# EAGLE design Displayboard (EAGLE 6.4)
Displayboard
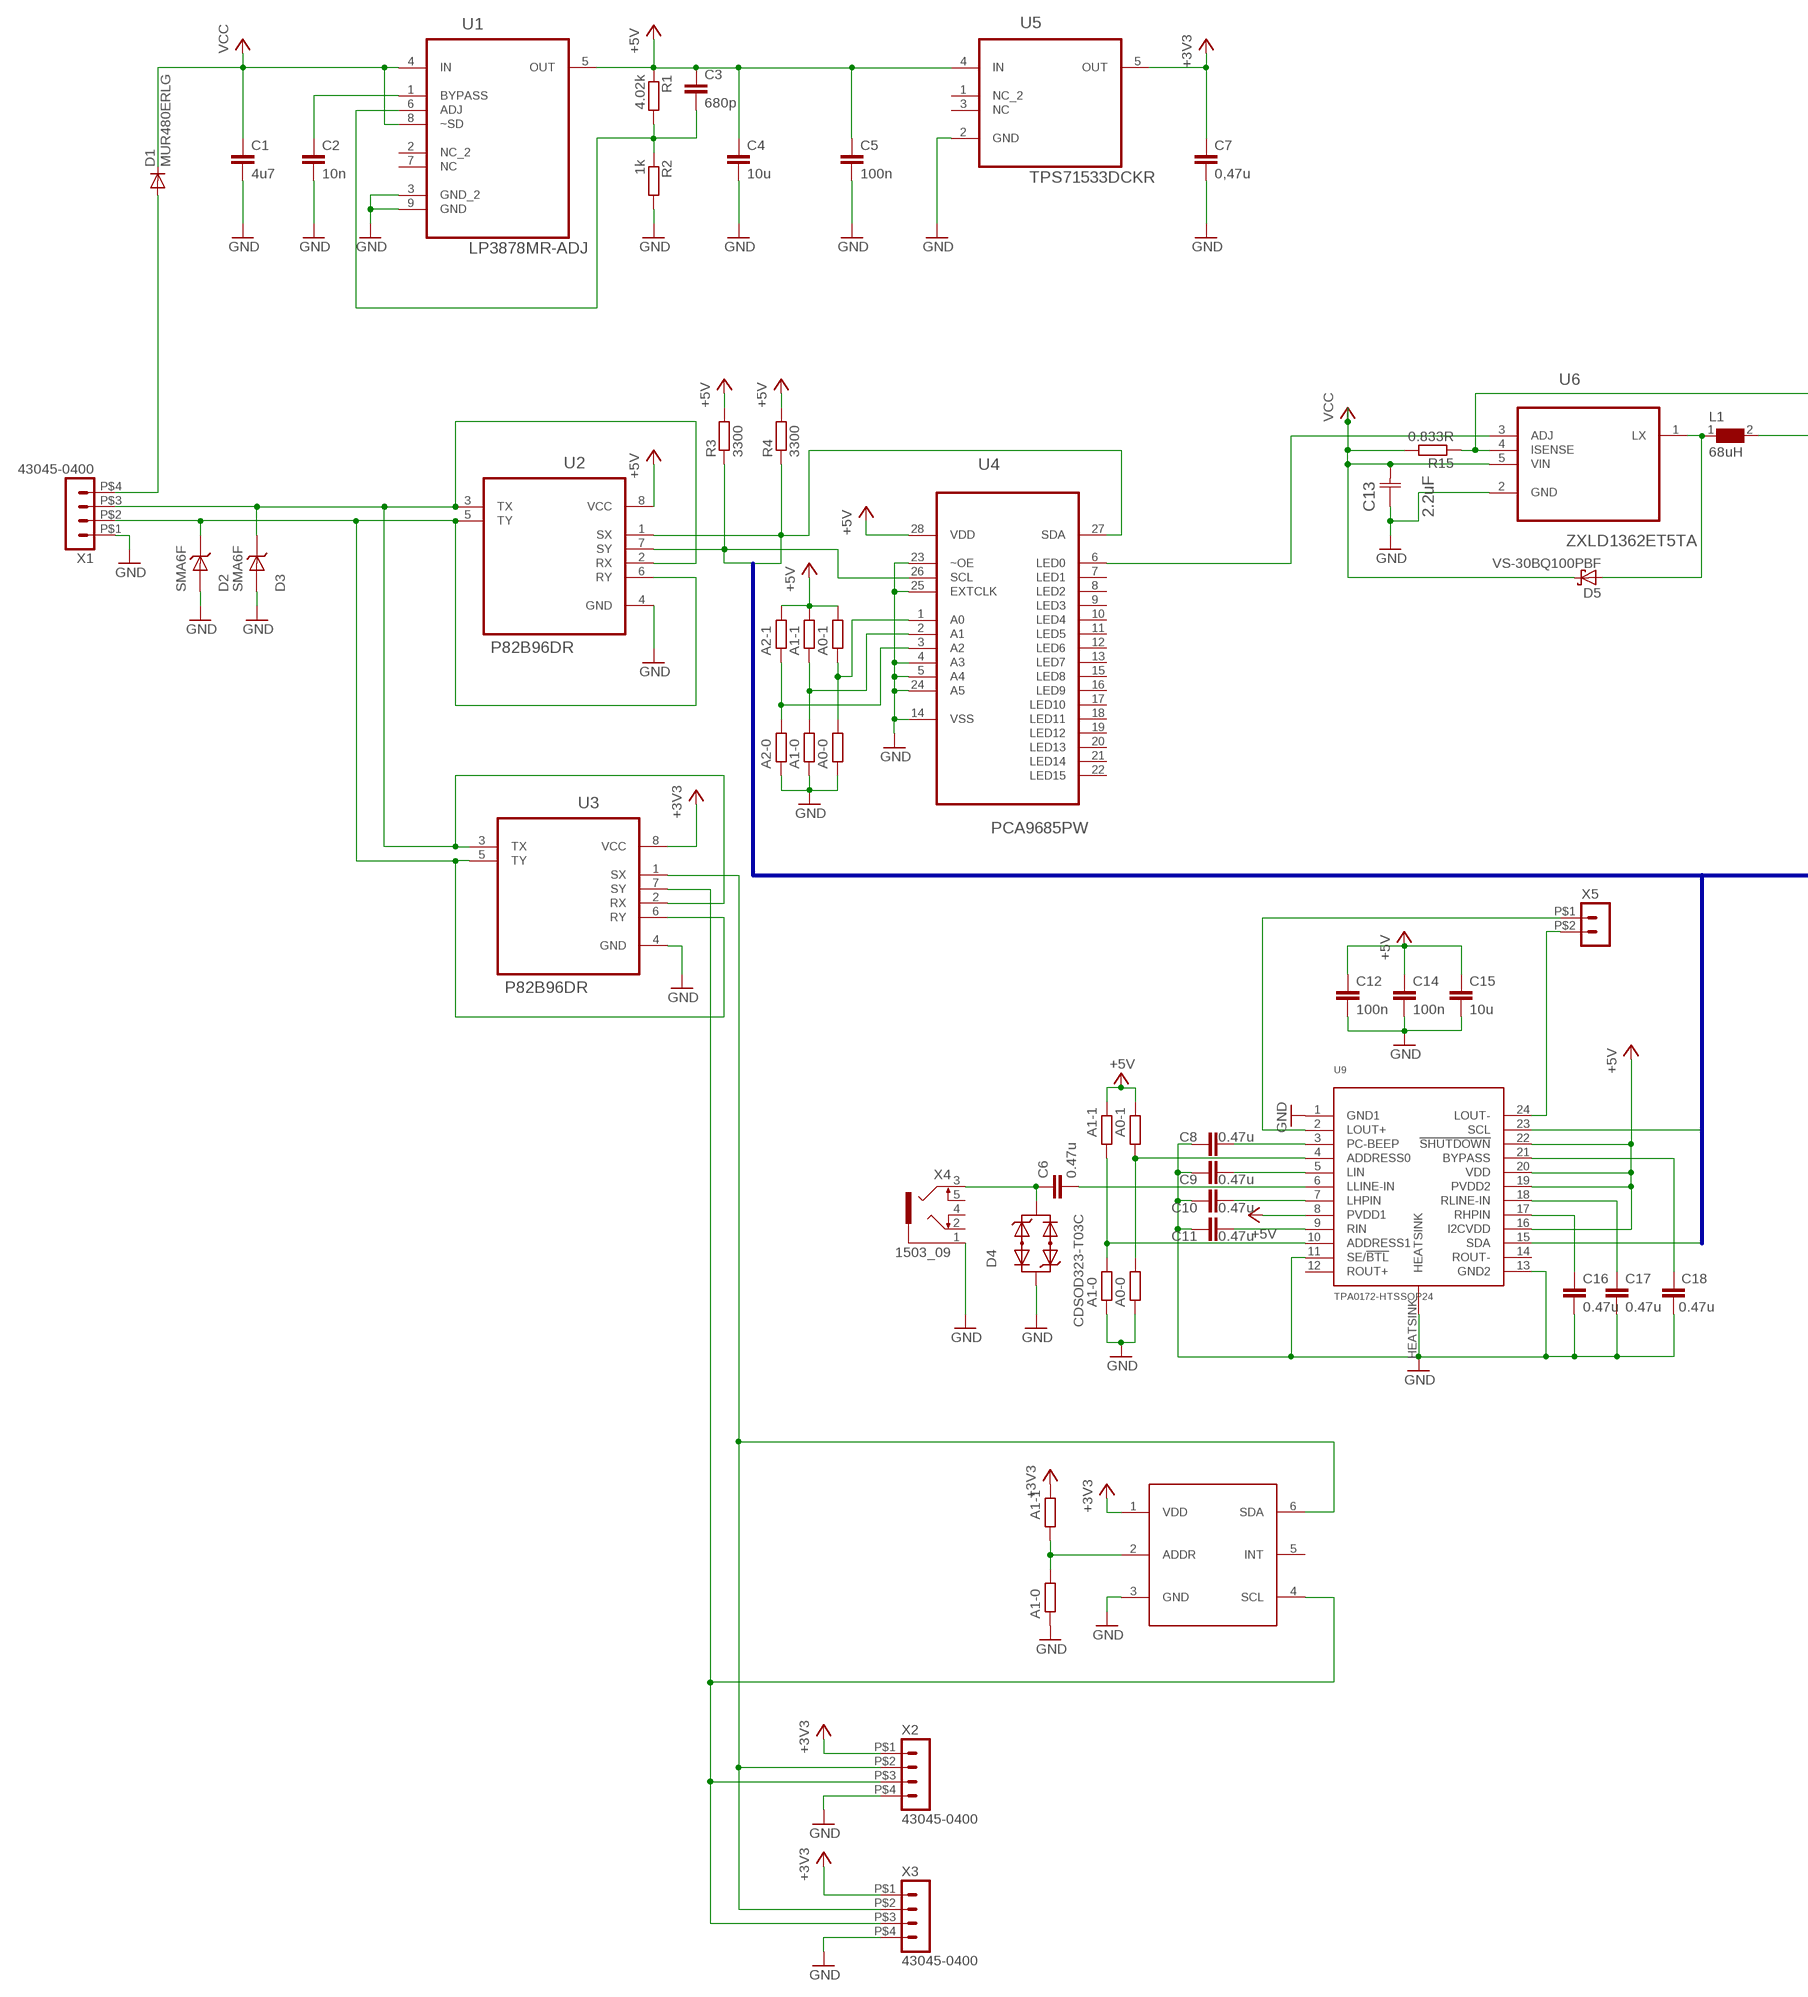
[diagram p0: schematic, sheet 1, part 1 of 2]
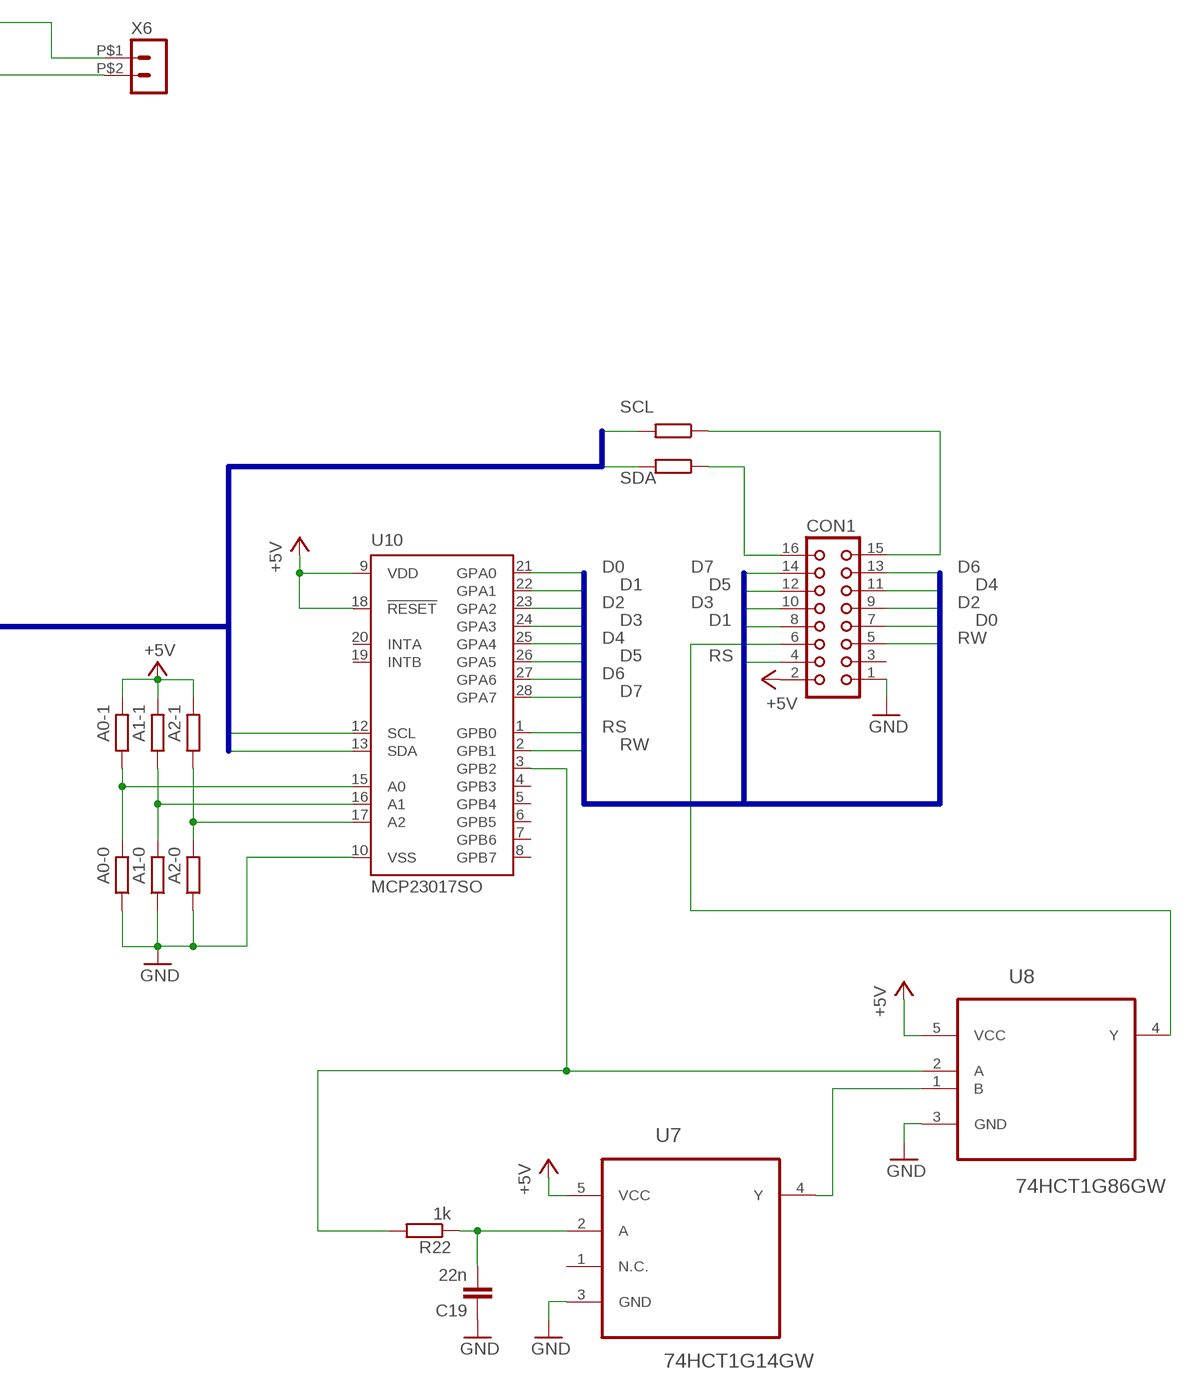
[diagram p1: schematic, sheet 1, part 2 of 2]

## Parts
C1  4u7  C-EUC0805  [C0805]
C2  10n  C-EUC0805  [C0805]
C3  680p  C-EUC0805  [C0805]
C4  10u  C-EUC0805  [C0805]
C5  100n  C-EUC0805  [C0805]
C6  0.47u  C-EUC0805  [C0805]
C7  0,47u  C-EUC0805  [C0805]
C8  0.47u  C-EUC0805  [C0805]
C9  0.47u  C-EUC0805  [C0805]
C10  0.47u  C-EUC0805  [C0805]
C11  0.47u  C-EUC0805  [C0805]
C12  100n  C-EUC0805  [C0805]
C13  2.2uF  08053C225KAT2A  [CAPC2013X152N]
C14  100n  C-EUC0805  [C0805]
C15  10u  C-EUC0805  [C0805]
C16  0.47u  C-EUC0805  [C0805]
C17  0.47u  C-EUC0805  [C0805]
C18  0.47u  C-EUC0805  [C0805]
C19  22n  C-EUC0805  [C0805]
CON1  CON16  [CON16]
D1  MUR480ERLG  MUR150RL  [DO41-10]
D2  SMA6F  [DO-221AC]
D3  SMA6F  [DO-221AC]
D4  CDSOD323-T03C  [SOD323]
D5  VS-30BQ100PBF  [DO-214AB]
L1  68uH  WE-PD4-74456168_L  [L]
R1  4.02k  R-EU_R0603  [R0603]
R2  1k  R-EU_R0603  [R0603]
R3  3300  R-EU_0204/7  [0204/7]
R4  3300  R-EU_0204/7  [0204/7]
R5  A2-1  R-EU_R0402  [R0402]
R6  A2-0  R-EU_R0402  [R0402]
R7  A1-1  R-EU_R0402  [R0402]
R8  A1-0  R-EU_R0402  [R0402]
R9  A0-1  R-EU_R0402  [R0402]
R10  A0-0  R-EU_R0402  [R0402]
R11  A1-1  R-EU_R0402  [R0402]
R12  A1-0  R-EU_R0402  [R0402]
R13  A0-1  R-EU_R0402  [R0402]
R14  A0-0  R-EU_R0402  [R0402]
R15  0.833R  R-EU_R0603  [R0603]
R16  A0-1  R-EU_R0402  [R0402]
R17  A0-0  R-EU_R0402  [R0402]
R18  A1-1  R-EU_R0402  [R0402]
R19  A1-0  R-EU_R0402  [R0402]
R20  A2-1  R-EU_R0402  [R0402]
R21  A2-0  R-EU_R0402  [R0402]
R22  1k  R-EU_0204/7  [0204/7]
R23  SCL  R-EU_R0402  [R0402]
R24  SDA  R-EU_R0402  [R0402]
R27  A1-1  R-EU_R0402  [R0402]
R28  A1-0  R-EU_R0402  [R0402]
U1  LP3878MR-ADJ  [SOIC127P600X168-8N]
U2  P82B96DR  [SOIC127P600X175-8N]
U3  P82B96DR  [SOIC127P600X175-8N]
U4  PCA9685PW  [SOP65P640X110-28N]
U5  TPS71533DCKR  [SOT65P210X110-5N]
U6  ZXLD1362ET5TA  [SOT95P270X145-5N]
U7  74HCT1G14GW  [SOT65P210X110-5N]
U8  74HCT1G86GW  [SOT65P210X110-5N]
U9  TPA0172-HTSSOP24  [HT-TSSOP-24]
U10  MCP23017SO  [SO28W]
U11  TSL2561  [TMB-6]
X1  43045-0400  HEADER_POS4_43045-0401  [43045-0400]
X2  43045-0400  HEADER_POS4_43045-0401  [43045-0400]
X3  43045-0400  HEADER_POS4_43045-0401  [43045-0400]
X4  1503_09  [1503_09]
X5  HEADER_POS2_43045-0200  [43045-0200]
X6  HEADER_POS2_43045-0200  [43045-0200]

## Nets
+3V3 [Normal Bcc]: C7.1 R27.2 U3.8(VCC) U5.5(OUT) U11.1(VDD) X2.P$1 X3.P$1
+5V [Normal Bcc]: C3.1 C4.1 C5.1 C12.1 C14.1 C15.1 CON1.2 R1.1 R3.2 R4.2 R5.2 R7.2 R9.2 R11.2 R13.2 R16.2 R18.2 R20.2 U1.5(OUT) U2.8(VCC) U4.28(VDD) U5.4(IN) U7.5(VCC) U8.5(VCC) U9.8(PVDD1) U9.16(I2CVDD) U9.19(PVDD2) U9.20(VDD) U9.22(!SHUTDOWN) U10.9(VDD) U10.18(!RESET)
D0: CON1.7 U10.21(GPA0)
D1: CON1.8 U10.22(GPA1)
D2: CON1.9 U10.23(GPA2)
D3: CON1.10 U10.24(GPA3)
D4: CON1.11 U10.25(GPA4)
D5: CON1.12 U10.26(GPA5)
D6: CON1.13 U10.27(GPA6)
D7: CON1.14 U10.28(GPA7)
GND: C1.2 C2.2 C4.2 C5.2 C7.2 C8.1 C9.1 C10.1 C11.1 C12.2 C13.1(C1) C14.2 C15.2 C16.2 C17.2 C18.1 C19.1 CON1.1 D2.AN D3.AN D4.P$1 R2.2 R6.1 R8.1 R10.1 R12.1 R14.1 R17.1 R19.1 R21.1 R28.1 U1.3(GND_2) U1.9(GND) U2.4(GND) U3.4(GND) U4.4(A3) U4.5(A4) U4.14(VSS) U4.23(~OE) U4.24(A5) U4.25(EXTCLK) U5.2(GND) U6.2(GND) U7.3(GND) U8.3(GND) U9.1(GND1) U9.11(SE/!BTL) U9.13(GND2) U9.HEATSINK U10.10(VSS) U11.3(GND) X1.P$1 X2.P$4 X3.P$4 X4.1
N$1 [LED Current]: R15.1 U6.4(ISENSE) X6.P$1
N$2: D3.KAT U2.2(RX) U2.3(TX) U3.2(RX) U3.3(TX) X1.P$3
N$3: R22.2 U8.2(A) U10.3(GPB2)
N$4: C16.1 U9.17(RHPIN)
N$5: C17.1 U9.18(RLINE-IN)
N$6 [LED Current]: L1.2 X6.P$2
N$7: U3.1(SX) U11.6(SDA) X2.P$2 X3.P$2
N$8: U4.6(LED0) U6.3(ADJ)
N$9: U3.7(SY) U11.4(SCL) X2.P$3 X3.P$3
N$10 [LED Current]: D5.A L1.1 U6.1(LX)
N$11: U9.24(LOUT-) X5.P$2
N$12: U9.2(LOUT+) X5.P$1
N$13: C6.2 U9.6(LLINE-IN)
N$14: C11.2 U9.9(RIN)
N$15: C10.2 U9.7(LHPIN)
N$16: C9.2 U9.5(LIN)
N$17: C8.2 U9.3(PC-BEEP)
N$18: R18.1 R19.2 U10.16(A1)
N$19: R16.1 R17.2 U10.15(A0)
N$20: R5.1 R6.2 U4.3(A2)
N$21: R20.1 R21.2 U10.17(A2)
N$22: D2.KAT U2.5(TY) U2.6(RY) U3.5(TY) U3.6(RY) X1.P$2
N$23: C18.2 U9.21(BYPASS)
N$24: C3.2 R1.2 R2.1 U1.6(ADJ)
N$25 [Big Vcc]: D1.A X1.P$4
N$26: C2.1 U1.1(BYPASS)
N$27: CON1.16 R24.1
N$28: CON1.15 R23.1
N$29: R7.1 R8.2 U4.2(A1)
N$30: C19.2 R22.1 U7.2(A)
N$31: U7.4(Y) U8.1(B)
N$32: CON1.6 U8.4(Y)
N$34: R27.1 R28.2 U11.2(ADDR)
N$41: R13.1 R14.2 U9.4(ADDRESS0)
N$42: R11.1 R12.2 U9.10(ADDRESS1)
N$43: R9.1 R10.2 U4.1(A0)
N$49: C6.1 D4.P$2 X4.3
RS: CON1.4 U10.1(GPB0)
RW: CON1.5 U10.2(GPB1)
SCL: R3.1 R23.2 U2.7(SY) U4.26(SCL) U9.23(SCL) U10.12(SCL)
SDA: R4.1 R24.2 U2.1(SX) U4.27(SDA) U9.15(SDA) U10.13(SDA)
VCC [Big Vcc]: C1.1 C13.2(C2) D1.C D5.K(C) R15.2 U1.4(IN) U1.8(~SD) U6.5(VIN)
Unconnected: CON1.3 U1.2(NC_2) U1.7(NC) U4.7(LED1) U4.8(LED2) U4.9(LED3) U4.10(LED4) U4.11(LED5) U4.12(LED6) U4.13(LED7) U4.15(LED8) U4.16(LED9) U4.17(LED10) U4.18(LED11) U4.19(LED12) U4.20(LED13) U4.21(LED14) U4.22(LED15) U5.1(NC_2) U5.3(NC) U7.1(N.C.) U9.12(ROUT+) U9.14(ROUT-) U10.4(GPB3) U10.5(GPB4) U10.6(GPB5) U10.7(GPB6) U10.8(GPB7) U10.19(INTB) U10.20(INTA) U11.5(INT) X4.2 X4.4 X4.5

## Buses
D[0..7],RS,RW
SDA,SCL

## Library data of the parts
C1-C12 C14-C19 = rcl:C-EU: CAPACITOR, European symbol
C13 = AVX_By_element14_Batch_1:08053C225KAT2A: Capacitor 0805; MPN: 08053C225KAT2A; OC_FARNELL: 1657931; OC_NEWARK: 10R5975; SUPPLIER: AVX; TOLERANCE: ±10%; VOLTAGERATING: 25V
CON1 = con-harting:CON16: CONNECTOR; OC_FARNELL: unknown; OC_NEWARK: unknown
D1 = diode:MUR150RL: DIODE
D2 D3 = MyComponents:SMA6F
D4 = MyComponents:CDSOD323-T03C
D5 = MyComponents:VS-30BQ100PBF
L1 = WE-PD4:WE-PD4: SMD-Power Inductors WE-PD4 - Current loading up to 35 A - Compact size - Low-loss ferrite core - High storage capacity - Industry standardized size - Application frequency range up to 10 MHz -- Is recommended for the application with switching regulators from National Semiconductor, Linear Technology, Texas Instruments and Fairchild Semiconductor -- Noise suppression -- Perfectly suitable for switching regulators with extremely high efficiency; MPN: 74456168; OC_FARNELL: 1636136; OC_NEWARK: 08P2689; PACKAGE: Type_L; SUPPLIER: Wuerth Elektronik
R1 R2 R5-R21 R23 R24 R27 R28 = resistor:R-EU_: RESISTOR, European symbol
R3 R4 R22 = rcl:R-EU_: RESISTOR, European symbol
U1 = Texas:LP3878MR-ADJ: Voltage Regulator; MPN: LP3878MR-ADJ; OC_FARNELL: 1286784; OC_NEWARK: 65K6513; PACKAGE: SOIC-8; SUPPLIER: NationalSemiconductor
U2 U3 = Texas:P82B96DR: DUAL BIDIRECTIONAL BUS BUFFER; MPN: P82B96DR; OC_FARNELL: 1576671; OC_NEWARK: 88K6385; PACKAGE: SOIC-8; SUPPLIER: Texas Instruments
U4 = NXP_By_element14_Batch_1:PCA9685PW: 16-channel, 12-bit PWM Fm+ I2C-bus LED controller; MPN: PCA9685PW; OC_FARNELL: 1854074; OC_NEWARK: 19T6398; PACKAGE: TSSOP-28; SUPPLIER: NXP
U5 = Texas:TPS71533DCKR: Linear Regulator; MPN: TPS71533DCKR; OC_FARNELL: 1135383; OC_NEWARK: 77C0815; PACKAGE: SC-70-5; SUPPLIER: Texas Instruments
U6 = ZEtex:ZXLD1362ET5TA: 60V 1A LED DRIVER WITH AEC-Q100; MPN: ZXLD1362ET5TA; OC_FARNELL: 1843876; OC_NEWARK: 12T2272; PACKAGE: SOT-5; SUPPLIER: DIODES INC.
U7 = NXP_By_element14_Batch_1:74HCT1G14GW: Inverting Schmitt trigger; MPN: 74HCT1G14GW; OC_FARNELL: 1085264; OC_NEWARK: 99K0543; PACKAGE: SOT-5; SUPPLIER: NXP
U8 = NXP_By_element14_Batch_1:74HCT1G86GW: 2-input EXCLUSIVE-OR gate; MPN: 74HCT1G86GW; OC_FARNELL: 1085266; OC_NEWARK: 99K0545; PACKAGE: SOT-5; SUPPLIER: NXP
U9 = MyComponents:TPA0172-HTSSOP24
U10 = microchip:MCP23017: http://ww1.microchip.com/downloads/en/DeviceDoc/21952a.pdf Source: http://ww1.microchip.com/downloads/en/DeviceDoc/21952a.pdf; MF: MICROCHIP; MPN: MCP23017-E/SO; OC_FARNELL: 1332087; OC_NEWARK: 31K2958
U11 = MyComponents:TSL2561
X1-X3 = con-molex-micro-fit-3_0:HEADER_POS4_?: Molex - Micro-Fit 3.0 Series connector, 3.00mm (0.118") pitch header, 4 positions.
X4 = con-lumberg:1503_09: Jack connectors according to JISC 6560, 3.5 mm Klinkeneinbaukupplung nach JISC 6560, 3,5 mm, 3-polig/ stereo, abgewinkelte Ausführung, mit 2 Öffnern und Lötaugen, für Leiterplatten Rückseitenmontage Source: http://www.lumberg.com/Produkte/PDFs/1503_09.pdf; OC_FARNELL: 1243244; OC_NEWARK: unknown
X5 X6 = con-molex-micro-fit-3_0:HEADER_POS2_?: Molex - Micro-Fit 3.0 Series connector, 3.00mm (0.118") pitch header, 2 positions.

## Net classes
0 default: width 0.254 mm, clearance 0.254 mm
1 Normal Bcc: width 0.254 mm, clearance 0.254 mm
2 Big Vcc: width 0.762 mm, clearance 0.254 mm
3 LED Current: width 0.381 mm, clearance 0.254 mm

## Board
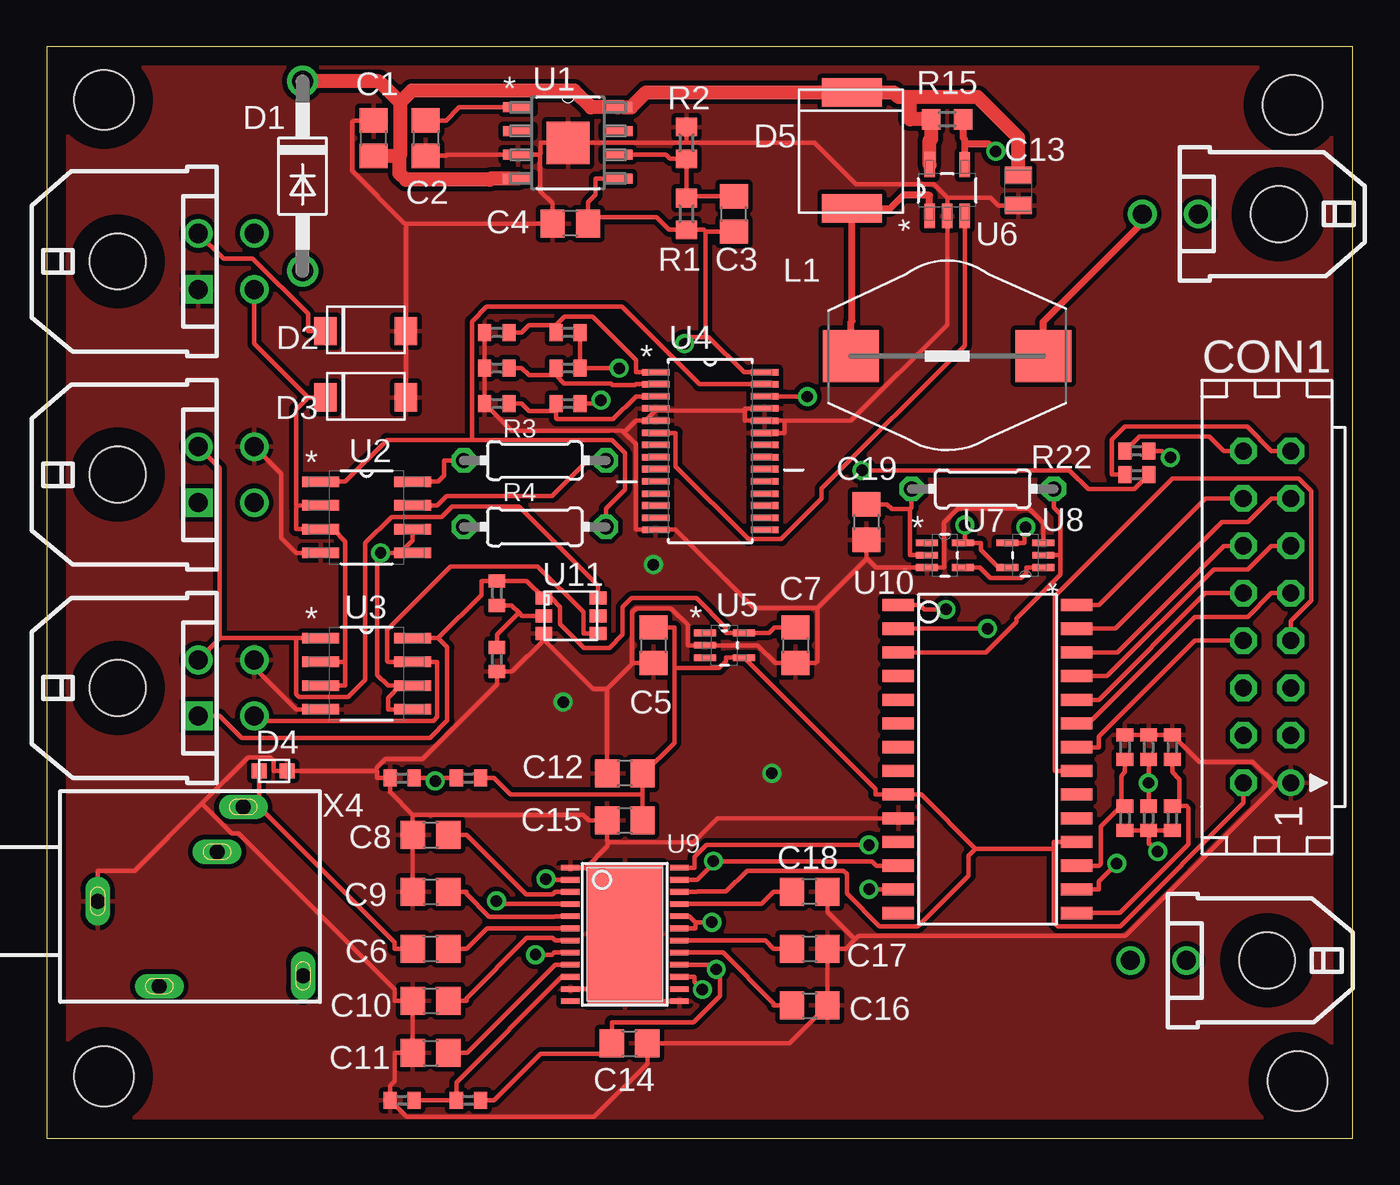
[diagram p2: board, top side]
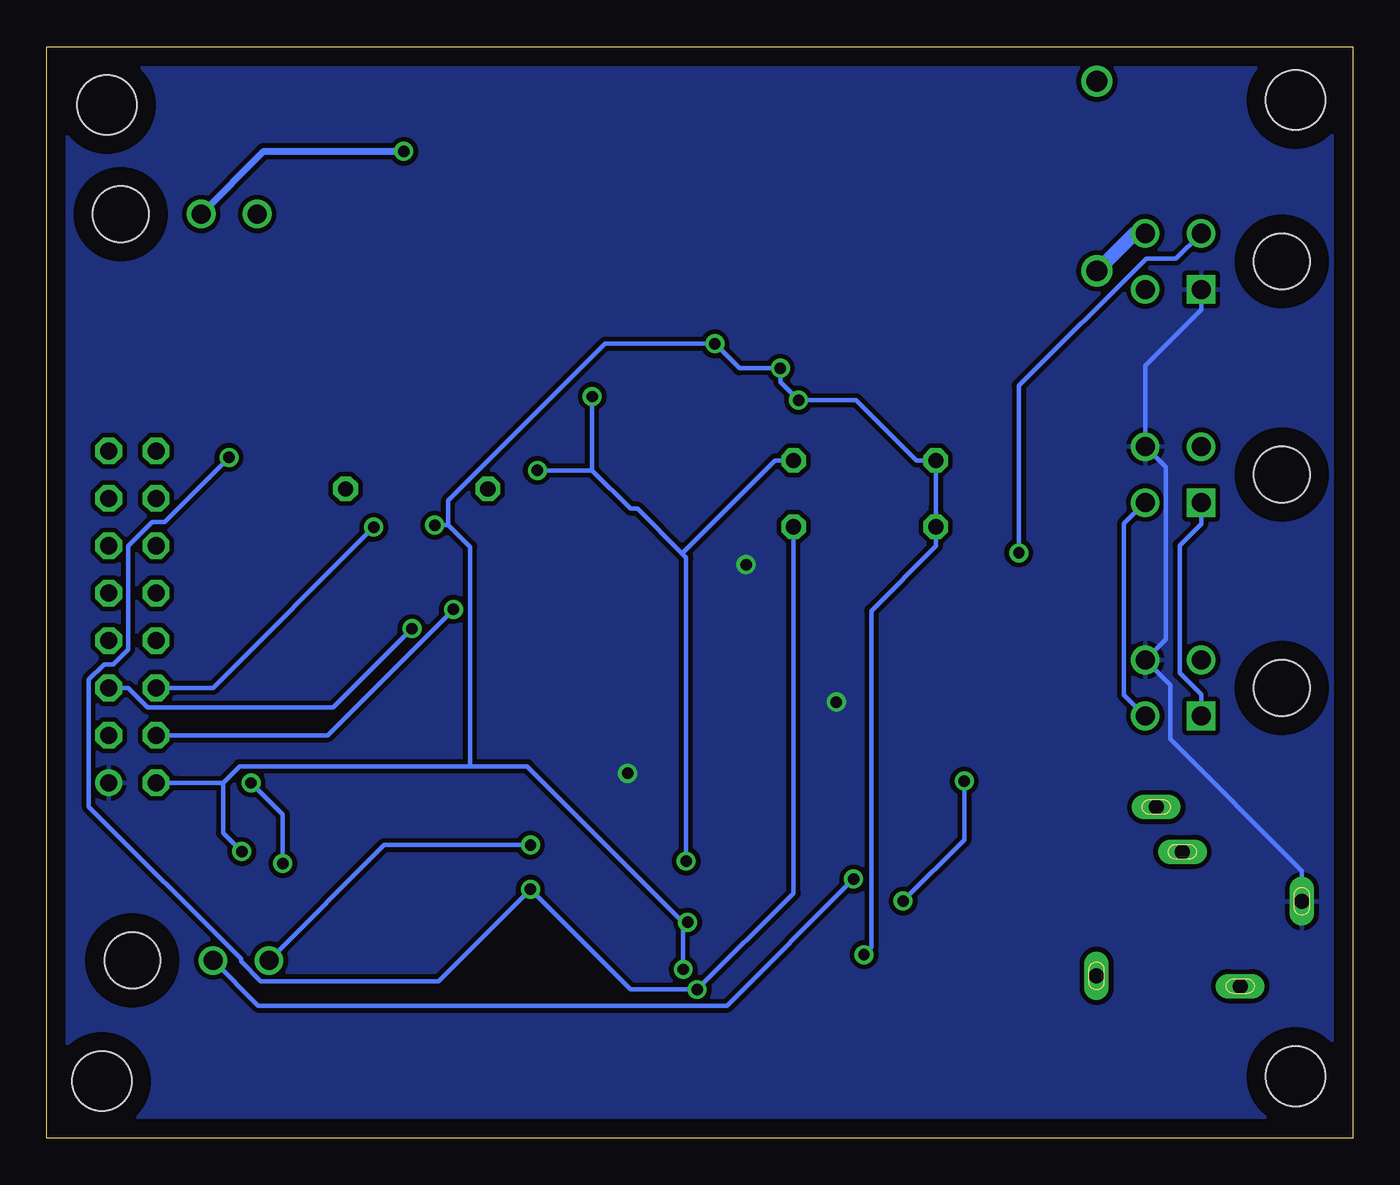
[diagram p3: board, bottom side, seen from below]

Size 70 x 58.5 mm. Coordinates in mm from the lower left corner, seen from the top.
Outline: 0,0 70,0 70,58.5 0,58.5 0,0
Copper layers (1*16): Top 0.035mm / dielectric 1.5mm / Bottom 0.035mm
Design rules "default": minimum track width 10mil, minimum drill 24mil, track to track 8mil, track to pad 8mil, pad to pad 8mil, via to via 8mil, smd to smd 8mil, copper to edge 40mil, drill to drill 8mil, minimum pad ring 10mil, minimum via ring 8mil, stop-mask expansion 4mil, vias tented up to drill 0mil, thermal gap 10mil
Holes 3.2 mm at 3.07,3.32 67.04,3.06 3.06,55.63 66.77,55.38

### Footprints (pad centres in the part's own frame; a part is rotated, then mirrored left to right if it is on the bottom)
C0805 = smd 1.3 x 1.5: 1 -0.95,0; 2 0.95,0
CAPC2013X152N = smd 0.914 x 1.448: 1 -0.813,0; 2 0.813,0
CON16 = drill 0.914: 1 -8.89,-1.27 | drill 0.914 octagon: 2 -8.89,1.27; 3 -6.35,-1.27; 4 -6.35,1.27; 5 -3.81,-1.27; 6 -3.81,1.27; 7 -1.27,-1.27; 8 -1.27,1.27; 9 1.27,-1.27; 10 1.27,1.27; 11 3.81,-1.27; 12 3.81,1.27; 13 6.35,-1.27; 14 6.35,1.27; 15 8.89,-1.27; 16 8.89,1.27
DO41-10 = drill 1.118: A 5.08,0; C -5.08,0
DO-221AC = smd 1.2 x 1.52: AN 2.11,-0.05; KAT -2.21,-0.05
SOD323 = smd 0.8 x 0.8: P$1 0.7,0; P$2 -0.8,0
DO-214AB = smd 1.52 x 3.2: A 4.78,-0.02; K -1.44,-0.02
L = smd 3 x 2.8: 1 -5.15,0; 2 5.15,0
R0603 = smd 1 x 1.1: 1 -0.85,0; 2 0.85,0
0204/7 = drill 0.813 octagon: 1 -3.81,0; 2 3.81,0
R0402 = smd 0.7 x 0.9: 1 -0.65,0; 2 0.65,0
SOIC127P600X168-8N = smd 1.6 x 0.533: 1 -2.667,1.905; 2 -2.667,0.635; 3 -2.667,-0.635; 4 -2.667,-1.905; 5 2.667,-1.905; 6 2.667,-0.635; 7 2.667,0.635; 8 2.667,1.905 | smd 2.286 x 2.286: 9 0,0
SOIC127P600X175-8N = smd 1.981 x 0.559: 1 -2.464,1.905; 2 -2.464,0.635; 3 -2.464,-0.635; 4 -2.464,-1.905; 5 2.464,-1.905; 6 2.464,-0.635; 7 2.464,0.635; 8 2.464,1.905
SOP65P640X110-28N = smd 1.473 x 0.356: 1 -2.921,4.216; 2 -2.921,3.581; 3 -2.921,2.921; 4 -2.921,2.286; 5 -2.921,1.626; 6 -2.921,0.965; 7 -2.921,0.33; 8 -2.921,-0.33; 9 -2.921,-0.965; 10 -2.921,-1.626; 11 -2.921,-2.286; 12 -2.921,-2.921; 13 -2.921,-3.581; 14 -2.921,-4.216; 15 2.921,-4.216; 16 2.921,-3.581; 17 2.921,-2.921; 18 2.921,-2.286; 19 2.921,-1.626; 20 2.921,-0.965; 21 2.921,-0.33; 22 2.921,0.33; 23 2.921,0.965; 24 2.921,1.626; 25 2.921,2.286; 26 2.921,2.921; 27 2.921,3.581; 28 2.921,4.216
SOT65P210X110-5N = smd 1.168 x 0.356: 1 -1.041,0.66; 2 -1.041,0; 3 -1.041,-0.66; 4 1.041,-0.66; 5 1.041,0.66
SOT95P270X145-5N = smd 1.321 x 0.559: 1 -1.372,0.94; 2 -1.372,0; 3 -1.372,-0.94; 4 1.372,-0.94; 5 1.372,0.94
SOT65P210X110-5N' = smd 1.168 x 0.356: 1 -0.965,0.66; 2 -0.965,0; 3 -0.965,-0.66; 4 0.965,-0.66; 5 0.965,0.66
HT-TSSOP-24 = smd 0.305 x 0.991: 1 -3.575,-2.918; 2 -2.925,-2.918; 3 -2.275,-2.918; 4 -1.625,-2.918; 5 -0.975,-2.918; 6 -0.325,-2.918; 7 0.325,-2.918; 8 0.975,-2.918; 9 1.625,-2.918; 10 2.275,-2.918; 11 2.925,-2.918; 12 3.575,-2.918; 13 3.575,2.918; 14 2.925,2.918; 15 2.275,2.918; 16 1.625,2.918; 17 0.975,2.918; 18 0.325,2.918; 19 -0.325,2.918; 20 -0.975,2.918; 21 -1.625,2.918; 22 -2.275,2.918; 23 -2.925,2.918; 24 -3.575,2.918 | smd 7.62 x 4.064: HEATSINK -0.02,0.02
SO28W = smd 0.65 x 1.7: 1 -7.62,-4.78; 2 -6.35,-4.78; 3 -5.08,-4.78; 4 -3.81,-4.78; 5 -2.54,-4.78; 6 -1.27,-4.78; 7 0,-4.78; 8 1.27,-4.78; 9 2.54,-4.78; 10 3.81,-4.78; 11 5.08,-4.78; 12 6.35,-4.78; 13 7.62,-4.78; 14 8.89,-4.78; 15 8.89,4.78; 16 7.62,4.78; 17 6.35,4.78; 18 5.08,4.78; 19 3.81,4.78; 20 2.54,4.78; 21 1.27,4.78; 22 0,4.78; 23 -1.27,4.78; 24 -2.54,4.78; 25 -3.81,4.78; 26 -5.08,4.78; 27 -6.35,4.78; 28 -7.62,4.78
TMB-6 = smd 0.9 x 0.7: 1 -1.55,1; 2 -1.55,0.05; 3 -1.55,-0.9; 4 1.35,-0.9; 5 1.35,0.05; 6 1.35,1
43045-0400 = drill 1.02 square: P$1 1.5,4.32 | drill 1.02: P$2 -1.5,4.32; P$3 1.5,7.32; P$4 -1.5,7.32 | hole 3: 0,0
1503_09 = drill 0.8 pad 1.2 long: 1 0,-2.1; 2 -4.55,-5.4; 3 5.05,-9.9; 4 -4,-13.1; 5 2.65,-8.5
43045-0200 = drill 1.02: P$1 0,4.32; P$2 0,7.32 | hole 3: 0,0

### Placement (x,y rotation side)
C1  17.53,53.59 90 top
C2  20.32,53.59 270 top
C3  36.83,49.53 90 top
C4  28.07,49.02 180 top
C5  32.51,26.42 270 top
C6  20.57,10.16 0 top
C7  40.13,26.42 270 top
C8  20.57,16.26 0 top
C9  20.57,13.21 0 top
C10  20.57,7.37 0 top
C11  20.57,4.57 0 top
C12  30.99,19.56 180 top
C13  52.07,50.8 90 top
C14  31.24,5.08 0 top
C15  30.99,17.02 180 top
C16  40.89,7.11 0 top
C17  40.89,10.16 0 top
C18  40.89,13.21 180 top
C19  43.94,33.02 90 top
CON1  65.41,27.94 90 top
D1  13.72,51.56 270 top
D2  17.14,43.31 0 top
D3  17.14,39.75 0 top
D4  12.19,19.68 0 top
D5  43.18,54.61 270 top
L1  48.26,41.91 0 top
R1  34.29,49.53 90 top
R2  34.29,53.34 90 top
R3  26.16,36.32 180 top
R4  26.16,32.77 180 top
R5  27.94,39.37 0 top
R6  24.13,39.37 0 top
R7  27.94,41.27 0 top
R8  24.13,41.27 0 top
R9  27.94,43.18 0 top
R10  24.13,43.18 0 top
R11  22.61,2.03 0 top
R12  19.05,2.03 0 top
R13  22.61,19.3 0 top
R14  19.05,19.3 0 top
R15  48.26,54.61 180 top
R16  60.33,17.14 270 top
R17  60.33,20.95 270 top
R18  59.05,17.14 270 top
R19  59.05,20.95 270 top
R20  57.78,17.14 270 top
R21  57.78,20.95 270 top
R22  50.16,34.8 0 top
R23  58.42,35.56 0 top
R24  58.42,36.83 0 top
R27  24.13,29.21 90 top
R28  24.13,25.65 90 top
U1  27.94,53.34 0 top
U2  17.14,33.27 0 top
U3  17.14,24.89 0 top
U4  35.56,36.83 0 top
U5  36.32,26.42 0 top
U6  48.26,50.8 90 top
U7  74HCT1G14GW  [SOT65P210X110-5N']  48.13,31.24 0 top
U8  74HCT1G86GW  [SOT65P210X110-5N']  52.45,31.24 180 top
U9  30.99,10.92 270 top
U10  50.42,20.95 270 top
U11  28.19,27.94 0 top
X1  3.81,46.99 270 top
X2  3.81,24.13 270 top
X3  3.81,35.56 270 top
X4  0.64,12.7 90 top
X5  65.41,9.53 90 top
X6  66.04,49.53 90 top

### Tracks (layer width: path | path; a pad name or v marks a point on that pad's centre or on a via)
+3V3
  Top 0.254: 20.98,26.8 23.3,29.11 23.3,29.86 R27.2 25.72,29.86 U11.1 27.05,28.94 27.52,28.48 27.52,27.56 28.79,26.28 30.16,26.28 30.87,27 30.87,28.47 31.34,28.94 34.82,28.94 36.4,27.36 36.4,27.08 U5.5 38.71,27.08 39,27.37 C7.1 | U3.8 20.98,26.8 | X2.P$1 9.28,22.63 10.44,21.46 20.55,21.46 21.46,22.38 21.46,26.31 20.98,26.8
  Bottom 0.254: X2.P$1 8.13,23.78 9.28,24.92 9.28,31.77 8.13,32.91 X3.P$1
+5V  (via drill 0.61 pad 1.02)
  Top 0.254: 49.22,31.9 49.22,32.83 v49.2,32.85 | 49.22,31.9 50.06,31.9 50.06,31.52 51,30.58 U8.5 | U7.5 49.22,31.9 | 34.78,11.57 34.78,11.25 U9.19 | 34.78,11.57 34.46,11.9 34.34,11.9 U9.20 | v35.65,11.57 34.78,11.57 | 49.78,15.51 49.41,15.14 49.41,14.07 46.7,11.36 44.63,11.36 42.88,13.11 42.88,14.16 42.7,14.34 37.52,14.34 36.41,13.23 34.87,13.23 34.84,13.2 34.78,13.2 U9.22 | 35.32,42.94 35.47,42.94 37.36,41.05 U4.28 | v34.19,42.58 34.55,42.94 35.32,42.94 | 35.32,42.94 35.32,48.58 | v30.68,41.27 v30.67,41.27 29.32,41.27 R7.2 R9.2 | v26.2,9.84 27.08,9.84 27.19,9.95 U9.8 | U9.16 35.63,9.3 v35.88,9.05 36.08,8.85 36.08,7.63 34.66,6.21 30.29,6.21 C14.1 30.29,4.8 30.29,4.51 26.47,4.51 23.99,2.03 R11.2 | 35.32,48.58 35.22,48.68 R1.1 33.36,48.68 32.68,49.36 29.02,49.36 | 35.32,48.58 36.55,48.58 C3.1 | R3.2 21.31,36.32 21.31,35.51 20.98,35.18 U2.8 | v29.7,39.55 29.51,39.55 29.32,39.37 R5.2 | U10.18 53.97,15.88 53.97,15.51 | CON1.2 64.14,17.96 57.54,11.36 54.19,11.36 53.97,11.58 53.97,15.51 | 53.97,15.51 | 49.78,15.51 | 49.78,15.51 53.97,15.51 | 31.94,18.43 24.86,18.43 23.99,19.3 R13.2 | 31.94,18.43 31.94,18.15 C15.1 | R18.2 59.05,15.76 59.13,15.76 v59.54,15.36 | 49.78,15.51 46.87,18.41 U10.9 44.41,18.41 44.41,18.71 U5.4 36.4,25.76 36.4,25.54 36.04,25.19 33.64,25.19 | 33.64,25.19 33.64,27.37 C5.1 | 31.94,19.49 33.64,21.19 33.64,25.19 | C12.1 31.94,19.49 | 31.94,19.49 31.94,19.39 31.94,18.43 | R16.2 59.89,16.5 R18.2 | R20.2 58.22,16.5 R18.2 | 29.02,49.36 29.02,50.15 29.43,50.56 29.43,51.44 U1.5 | C4.1 29.02,49.36
  Bottom 0.254: 48.48,32.87 49.18,32.87 v49.2,32.85 | 48.48,32.87 48.48,34.16 40.07,42.58 v34.19,42.58 32.88,41.27 v30.68,41.27 30.68,40.53 v29.7,39.55 26.63,39.55 23.39,36.32 R3.2 22.35,33.81 22.35,33.29 R4.2 22.35,31.72 25.81,28.27 25.81,10.22 v26.2,9.84 | 47.3,19.93 47.3,31.69 48.48,32.87 | 35.88,11.57 44.24,19.93 47.3,19.93 | v35.88,9.05 35.88,11.57 | 35.88,11.57 v35.65,11.57 | 47.3,19.93 59.67,19.93 60.55,19.05 | 60.55,19.05 63.04,19.05 CON1.2 | 60.55,19.05 60.55,16.37 v59.54,15.36
D0
  Top 0.254: CON1.7 66.67,27.71 67.77,28.81 67.77,34.68 67.1,35.35 60.32,35.35 54.02,29.05 54.02,19.68 U10.21
D1
  Top 0.254: CON1.8 61.52,26.67 56.38,21.53 56.38,20.95 U10.22
D2
  Top 0.254: CON1.9 65.63,29.21 64.36,27.94 61.54,27.94 55.83,22.23 U10.23
D3
  Top 0.254: U10.24 56.38,23.5 62.09,29.21 CON1.10
D4
  Top 0.254: CON1.11 65.63,31.75 64.36,30.48 62.54,30.48 56.83,24.77 U10.25
D5
  Top 0.254: U10.26 57.38,26.04 63.09,31.75 CON1.12
D6
  Top 0.254: U10.27 57.27,27.3 62.98,33.02 64.36,33.02 65.63,34.29 CON1.13
D7
  Top 0.254: U10.28 56.38,28.57 62.09,34.29 CON1.14
GND  (via drill 0.61 pad 1.02)
  Top 0.254: U3.4 13.36,22.99 11.13,25.22 X2.P$4 | U8.3 53.42,32.98 52.64,33.76 48.84,33.76 48.08,33 48.08,30.58 U7.3 44.45,30.58 43.96,31.08 | 48.26,50.42 47.56,51.12 43.38,51.12 41.14,53.36 34.29,53.36 | 48.26,50.42 50.58,50.42 51.02,49.99 C13.1 | D3.AN D2.AN 19.25,49.02 | 48.26,50.42 U6.2 48.26,43.62 43.1,38.46 39.55,38.46 | 43.32,10.65 42.82,10.16 C17.2 C16.2 39.81,5.08 C14.2 32.19,4 29.35,1.15 19.28,1.15 R12.1 18.4,2.81 18.64,3.06 18.64,4.57 C11.1 C10.1 18.64,7.37 18.64,7.97 10.28,16.34 9.9,16.34 8.31,17.93 | 65.89,18.92 57.81,10.85 43.52,10.85 43.32,10.65 | 43.32,10.65 41.84,12.13 C18.1 | 37.41,38.99 37.41,38.46 U4.24 39.55,38.46 | 37.41,38.99 37.41,39.12 U4.25 | 37.41,38.99 32.64,38.99 | 32.64,38.99 U4.4 | 32.11,38.46 32.64,38.99 | 32.11,38.46 31.57,38.46 30.94,37.83 | U4.5 32.11,38.46 | 30.94,37.83 31.57,37.2 31.57,32.61 U4.14 33.71,32.61 37.9,28.42 41.3,28.42 | 30.94,37.83 30.84,37.92 24.93,37.92 R6.1 R8.1 R10.1 | 19.25,49.02 19.19,49.02 16.38,51.84 16.38,54.47 16.45,54.54 C1.2 | 19.25,49.02 C4.2 27.12,50.1 26.45,50.77 26.45,52.65 26.4,52.7 | 26.4,52.7 26.47,52.77 26.47,53.34 U1.9 34.27,53.34 34.29,53.36 | 26.4,52.7 26.3,52.7 U1.3 21.46,52.7 21.4,52.64 C2.2 | CON1.1 66.55,18.92 65.89,18.92 | 65.89,18.92 | 65.89,18.92 64.64,20.17 61.76,20.17 R17.1 59.84,21.61 R19.1 R21.1 | U4.23 39.55,37.8 39.55,38.46 | R2.2 34.29,53.36 | 31.01,7.98 31.64,7.35 U9.13 | 31.01,7.98 28.91,7.98 28.9,8 U9.11 | 8.31,17.93 4.71,14.34 2.73,14.34 X4.1 | 8.31,17.93 10.79,20.41 11.98,20.41 12.16,20.23 12.16,19.68 D4.P$1 13.62,19.68 17.67,19.68 | 43.96,31.08 43.94,31.09 43.94,31.58 C19.1 | 43.96,31.08 41.3,28.42
  Top 0.254: 41.3,28.42 41.3,25.56 41.21,25.47 C7.2 39.59,25.47 39.05,25.47 38.1,26.42 36.2,26.42 U5.2 34.37,26.42 34.37,27.49 33.46,28.4 31.57,28.4 31.38,28.21 31.38,25.52 31.43,25.47 | 30.04,24.07 C12.2 | 30.04,24.07 29.27,24.07 26.64,26.7 | 31.43,25.47 30.04,24.07 | 17.67,19.68 17.67,19.85 18.16,20.34 20.14,20.34 24.13,24.32 R28.1 24.91,25 24.95,25 26.64,26.7 | 17.67,19.68 17.72,19.64 17.72,19.3 R14.1 18.4,18.52 18.44,18.52 19.62,17.34 | U2.4 13.36,31.37 12.57,32.16 12.57,35.62 X3.P$4 | 19.62,17.34 28.74,17.34 29.06,17.02 C15.2 30.04,15.94 30.06,15.91 30.06,15.85 | 28.9,14.5 30.06,15.66 30.06,15.85 | 31.43,25.47 31.97,25.47 C5.2 | U11.3 26.64,26.7 | 30.06,15.85 34.66,15.85 35.96,17.14 44.46,17.14 U10.10 | 31.01,7.98 U9.HEATSINK 31.01,12.38 28.9,14.5 | U9.1 28.9,14.5 | C9.1 C8.1 19.62,17.34
  Bottom 0.254: X4.1 2.73,14.34 9.78,21.39 9.78,24.28 X2.P$4 10.03,26.73 10.03,35.96 X3.P$4 11.13,41.4 8.13,44.4 X1.P$1
  other vias: 27.69,23.37 38.86,19.56 32.51,30.73
  pour Top: 0,58.42 70.1,58.42 69.85,0 0,0
  pour Bottom: 0,58.42 70.1,58.42 69.85,0 0,0
N$1  (via drill 0.61 pad 1.02)
  Top 0.381: 49.2,53.28 49.2,53.53 49.11,53.62 R15.1 | U6.4 49.2,53.28 | v50.87,52.89 50.48,53.28 49.2,53.28
  Bottom 0.381: X6.P$1 58.36,52.89 v50.87,52.89
N$2
  Top 0.254: 13.46,33.91 13.36,33.81 13.36,32.64 U2.3 15.34,32.64 16,31.98 16,25.53 | 13.46,33.91 13.36,33.91 13.36,39.06 14.01,39.7 | U2.2 13.46,33.91 | D3.KAT 14.01,39.7 | X1.P$3 11.13,42.58 14.01,39.7 | U3.2 16,25.53 | U3.3 16,24.26 16,25.53
N$3
  Top 0.254: 54.33,31.24 54.33,33.45 53.98,33.81 R22.2 | 54.33,31.24 54.33,30.21 51.97,27.84 51.97,27.67 50.34,26.04 U10.3 | 54.33,31.24 54.2,31.24 U8.2
N$4
  Top 0.254: U9.17 36.24,9.95 38.96,7.22 38.96,7.11 C16.1
N$5
  Top 0.254: C17.1 38.96,10.16 38.53,10.6 U9.18
N$6
  Top 0.381: L1.2 53.41,43.76 58.72,49.06 X6.P$2
N$7
  Top 0.254: 13.36,26.8 9.28,26.8 | 13.36,26.8 13.36,23.81 13.52,23.65 16.15,23.65 17.06,24.55 17.06,31.88 18.48,33.3 21.18,33.3 21.72,33.85 25.32,33.85 29.54,29.62 U11.6 | U3.1 13.36,26.8 | 9.28,26.8 9.28,26.78 X2.P$2 | X3.P$2 9.28,35.91 9.28,26.8
N$8
  Top 0.254: U6.3 49.2,42.48 41.53,34.81 41.53,34.28 39.35,32.1 37.6,32.1 33.71,36 33.71,37.8 U4.6
N$9
  Top 0.254: X2.P$3 11.39,22.37 20.73,22.37 20.93,22.57 20.93,25.53 U3.7 18.29,25.53 18.24,25.58 18.24,27.24 21.64,30.65 26.31,30.65 28.76,28.2 28.76,27.04 U11.4
  Bottom 0.254: X3.P$3 12.26,32.93 12.26,23.76 X2.P$3
N$10
  Top 0.381: L1.1 43.11,43.76 43.16,43.8 D5.A 45.2,49.83 45.91,50.53 47.32,50.53 U6.1
N$11  (via drill 0.61 pad 1.02)
  Top 0.254: v44.07,15.71 35.36,15.71 34.73,15.08 34.73,14.5 U9.24
  Bottom 0.254: X5.P$2 51.9,15.71 v44.07,15.71
N$12  (via drill 0.61 pad 1.02)
  Top 0.254: v26.75,13.89 27.2,13.89 27.25,13.85 U9.2
  Bottom 0.254: X5.P$1 58.66,7.1 33.55,7.1 v26.75,13.89
N$13
  Top 0.254: C6.2 22.5,10.16 23.59,11.25 27.25,11.25 U9.6
N$14
  Top 0.254: U9.9 27.25,9.3 22.52,4.57 C11.2
N$15
  Top 0.254: U9.7 27.25,10.6 27.12,10.73 25.73,10.73 22.5,7.5 22.5,7.37 C10.2
N$16
  Top 0.254: U9.5 27.25,11.9 27.22,11.87 23.72,11.87 22.5,13.09 22.5,13.21 C9.2
N$17
  Top 0.254: C8.2 22.5,16.26 25.7,13.05 27.1,13.05 27.25,13.2 U9.3
N$18  (via drill 0.61 pad 1.02)
  Top 0.254: v59.05,19.04 59.05,18.48 R18.1 | v59.05,19.04 | v59.05,19.04 59.05,19.62 R19.2 | U10.16 56.38,13.34 56.38,13.75 v57.35,14.72
  Bottom 0.254: v59.05,19.04 57.35,17.34 v57.35,14.72
N$19
  Top 0.254: U10.15 57.5,12.06 61.19,15.75 61.19,17.71 61.1,17.8 60.71,17.8 | R17.2 60.33,19.62 60.71,19.24 60.71,17.8 | R16.1 60.71,17.8
N$20
  Top 0.254: R6.2 25.46,39.37 25.85,38.98 27.29,38.98 | 27.29,38.98 27.29,38.59 27.34,38.54 30.36,38.54 31.57,39.75 U4.3 | R5.1 27.29,38.98
N$21
  Top 0.254: 57.58,17.8 57.58,19.42 57.78,19.62 R21.2 | U10.17 56.38,14.61 56.49,14.71 56.49,16.7 57.58,17.8 | R20.1 57.58,17.8
N$22  (via drill 0.61 pad 1.02)
  Top 0.254: U3.5 18.29,22.99 18.29,23.6 18.95,24.26 | 18.95,24.26 18.29,24.26 17.71,24.83 17.71,31.18 v17.9,31.37 18.29,31.37 18.95,31.37 | U3.6 18.95,24.26 | 18.95,31.37 19.61,32.03 U2.6 | U2.5 18.95,31.37 | D2.KAT 14.01,43.26 14.01,44.19 11.05,47.14 9.48,47.14 X1.P$2
  Bottom 0.254: X1.P$2 9.48,47.14 11.08,47.14 17.9,40.32 v17.9,31.37
N$23
  Top 0.254: C18.2 38.96,13.21 38.3,12.55 U9.21
N$24
  Top 0.254: 34.29,50.48 R1.2 | 33.85,52.49 34.29,52.05 34.29,50.48 | 34.29,50.48 35.75,50.48 C3.2 | 33.85,52.49 33.41,52.49 33.2,52.7 U1.6 | R2.1 33.85,52.49
N$25
  Bottom 0.762: X1.P$4 11.71,48.49 D1.A
N$26
  Top 0.254: C2.1 21.4,54.54 22.1,55.24 U1.1
N$27
  Top 0.254: CON1.16 63.09,36.83 62.31,37.61 58.55,37.61 R24.1
N$28
  Top 0.254: R23.1 57.09,35.56 57.09,37.44 57.78,38.13 64.33,38.13 65.63,36.83 CON1.15
N$29
  Top 0.254: U4.2 31.57,40.41 31.52,40.36 30.32,40.36 30.24,40.44 27.73,40.44 27.29,40.88 | R8.2 25.46,41.27 25.85,40.88 27.29,40.88 | R7.1 27.29,40.88
N$30
  Top 0.254: 46.25,33.71 46.35,33.81 R22.1 | 46.25,33.71 46.25,31.24 U7.2 | 46.25,33.71 45.29,33.71 45.02,33.97 C19.2
N$31
  Top 0.254: U7.4 50.01,30.58 50.57,30.02 52.23,30.02 52.5,30.3 52.5,30.58 U8.1
N$32  (via drill 0.61 pad 1.02)
  Top 0.254: v52.47,32.74 52.4,32.67 52.4,31.9 U8.4
  Bottom 0.254: v52.47,32.74 61.08,24.13 63.09,24.13 CON1.6
N$34
  Top 0.254: 25.31,28.16 24.91,28.56 R27.1 | U11.2 25.48,27.99 25.31,28.16 | 25.31,28.16 24.13,26.98 R28.2
N$41  (via drill 0.61 pad 1.02)
  Top 0.254: v24.1,12.71 24.26,12.55 27.25,12.55 U9.4 | R13.1 21.28,19.3 21.12,19.14 v20.83,19.14 20.54,19.14 20.38,19.3 R14.2
  Bottom 0.254: v20.83,19.14 20.83,15.98 v24.1,12.71
N$42
  Top 0.254: U9.10 27.6,8.65 21.96,3.01 R11.1 20.38,2.03 R12.2
N$43
  Top 0.254: U4.1 31.57,41.05 31.57,41.71 29.26,44.03 27.75,44.03 27.29,43.57 | R10.2 25.46,43.18 25.85,43.57 27.29,43.57 | R9.1 27.29,43.57
N$49
  Top 0.254: 11.39,17.75 D4.P$2 | 11.39,17.75 18.64,10.5 18.64,10.16 C6.1 | 11.39,17.75 11.35,17.75 X4.3
RS  (via drill 0.61 pad 1.02)
  Top 0.254: U10.1 46.82,28.57 47.05,28.34 v48.2,28.34
  Bottom 0.254: v48.2,28.34 54.95,21.59 63.09,21.59 CON1.4
RW  (via drill 0.61 pad 1.02)
  Top 0.254: U10.2 v50.42,27.3
  Bottom 0.254: v50.42,27.3 54.64,23.09 64.59,23.09 65.63,24.13 CON1.5
SCL  (via drill 0.61 pad 1.02)
  Top 0.254: v43.7,35.79 54.81,35.79 55.82,34.78 58.29,34.78 R23.2 | v40.76,39.75 39.55,39.75 U4.26 | U9.23 34.86,13.85 35.73,14.72 v35.73,14.85 44.22,14.85 44.46,14.61 U10.12 | U2.7 20.93,33.91 21.44,34.42 27.08,34.42 28.98,36.32 R3.1
  Bottom 0.254: 40.76,35.79 v40.76,39.75 | 35.95,31.34 38.34,33.73 38.7,33.73 40.76,35.79 | 40.76,35.79 v43.7,35.79 | v35.73,14.85 35.73,31.12 35.95,31.34 | 35.95,31.34 30.96,36.32 R3.1
SDA  (via drill 0.61 pad 1.02)
  Top 0.254: 22.8,37.42 30.29,37.42 30.99,36.71 30.99,34.77 29.97,33.76 R4.1 | 22.8,37.42 18.24,37.42 16,35.18 U2.1 | 22.8,37.42 22.8,43.77 23.58,44.55 30.83,44.55 34.97,40.41 U4.27 | v35.14,7.96 34.73,8.37 34.73,8.65 U9.15 | R24.2 59.75,36.83 60.1,36.48 v60.22,36.48 | v44.07,13.34 44.08,13.34 44.46,13.34 U10.13
  Bottom 0.254: R4.1 29.97,13.13 v35.14,7.96 38.7,7.96 v44.07,13.34 49,8.42 58.53,8.42 59.59,9.48 59.59,9.6 67.74,17.76 67.74,24.57 66.92,25.4 66.44,25.4 65.63,26.2 65.63,31.74 64.36,33.02 63.69,33.02 v60.22,36.48
VCC
  Top 0.762: U1.4 23.84,51.44 23.76,51.36 19.25,51.36 18.91,51.7 18.91,52.64 | C1.1 18.91,52.64 | 18.93,55.52 18.93,52.67 18.91,52.64 | 18.93,55.52 19.57,56.15 28.27,56.15 29.17,55.24 U1.8 30.97,55.24 31.32,55.24 32.13,56.05 D5.K 45.4,56.05 45.65,55.8 46.27,55.8 | 18.93,55.52 17.81,56.64 D1.C | C13.2 52.07,53.63 49.9,55.8 46.27,55.8 | U6.5 47.32,53.47 47.41,53.56 R15.2 46.27,54.61 46.27,55.8